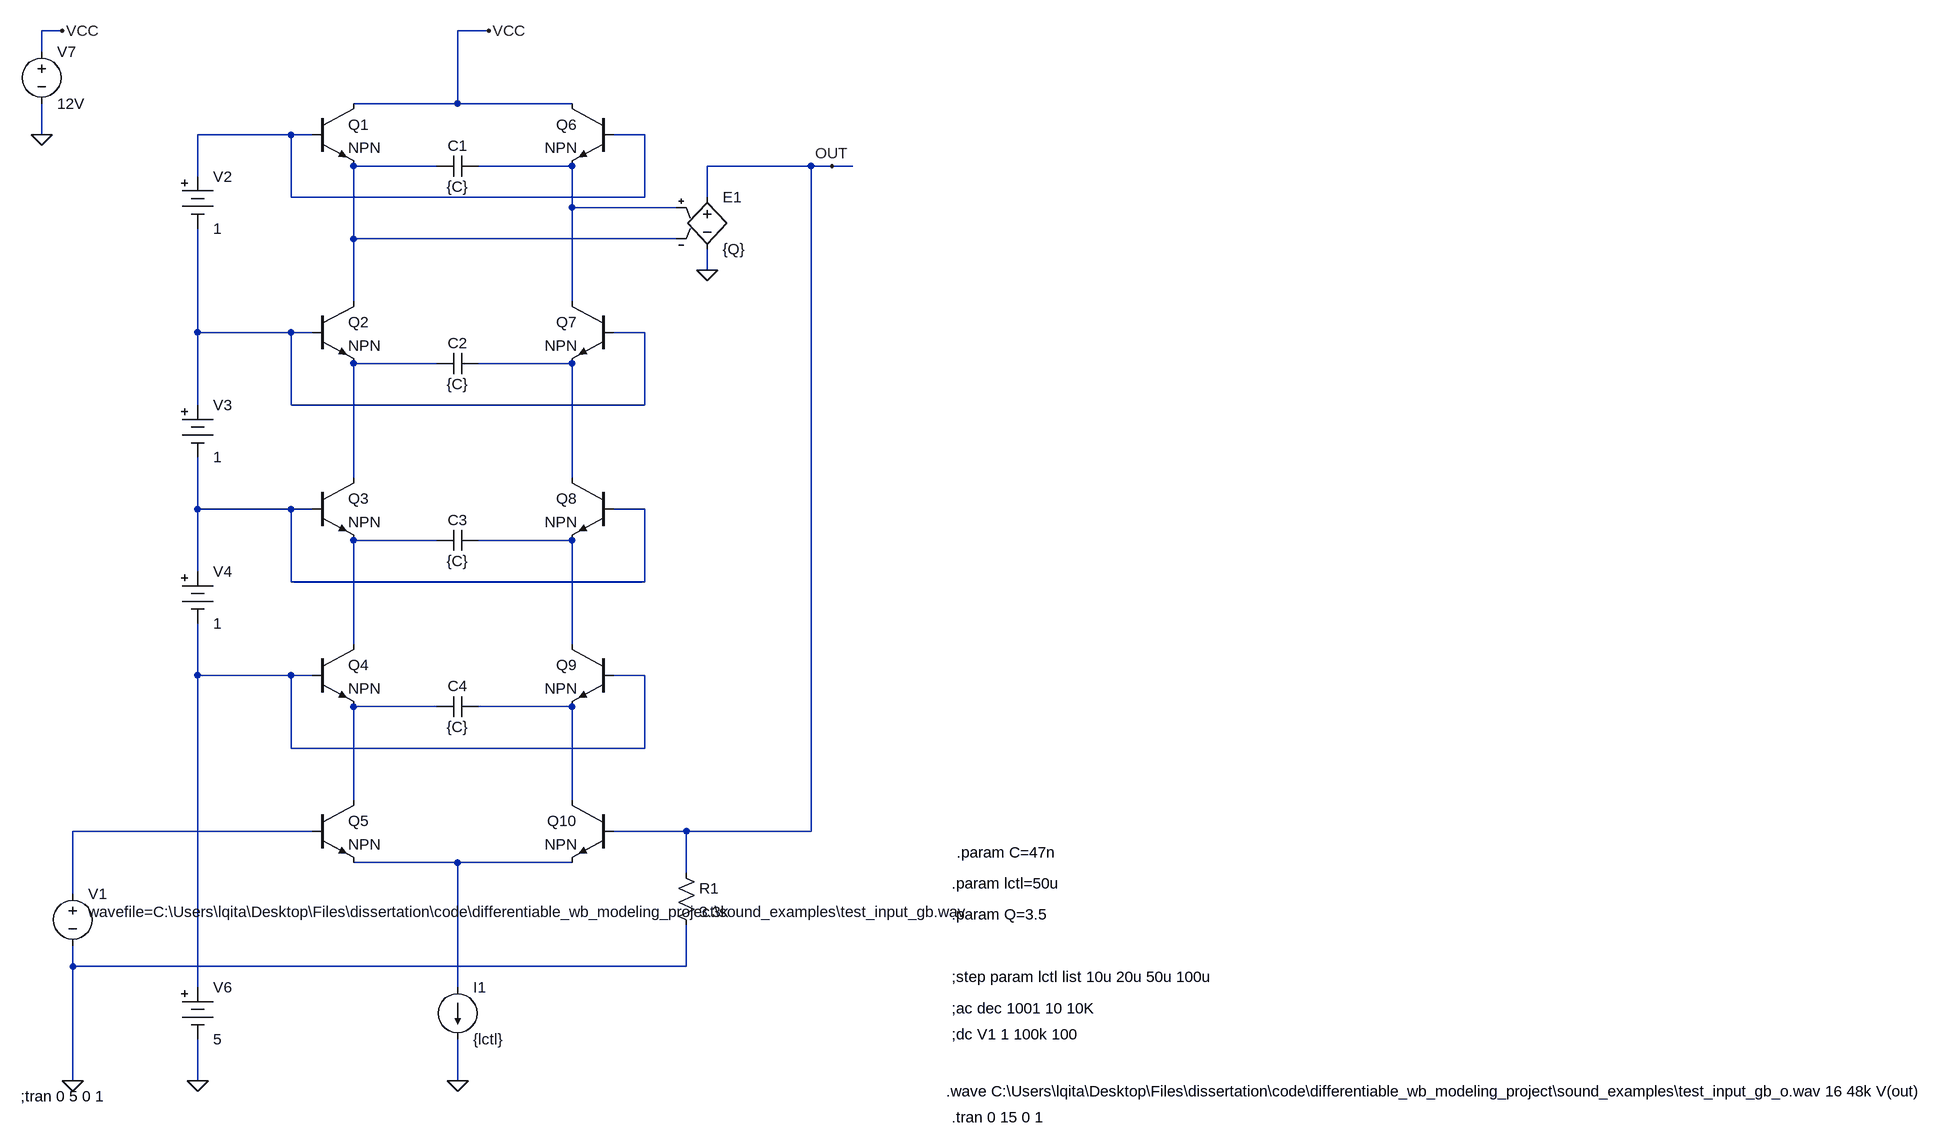
[diagram p0: schematic MoogVCF.asc]
MoogVCF.asc, the LTspice schematic file:
Version 4
SHEET 1 2832 1924
WIRE -272 -256 -304 -256
WIRE 384 -256 336 -256
WIRE -304 -224 -304 -256
WIRE 336 -144 336 -256
WIRE 336 -144 176 -144
WIRE 512 -144 336 -144
WIRE -304 -96 -304 -144
WIRE 80 -96 -64 -96
WIRE 112 -96 80 -96
WIRE 624 -96 576 -96
WIRE 304 -48 176 -48
WIRE 512 -48 368 -48
WIRE 880 -48 720 -48
WIRE 912 -48 880 -48
WIRE 944 -48 912 -48
WIRE -64 -32 -64 -96
WIRE 80 0 80 -96
WIRE 624 0 624 -96
WIRE 624 0 80 0
WIRE 720 0 720 -48
WIRE 512 16 512 -48
WIRE 672 16 512 16
WIRE 176 64 176 -48
WIRE 672 64 176 64
WIRE 720 112 720 80
WIRE 176 160 176 64
WIRE 512 160 512 16
WIRE -64 208 -64 48
WIRE 80 208 -64 208
WIRE 112 208 80 208
WIRE 624 208 576 208
WIRE 304 256 176 256
WIRE 512 256 368 256
WIRE -64 320 -64 208
WIRE 80 320 80 208
WIRE 624 320 624 208
WIRE 624 320 80 320
WIRE 176 432 176 256
WIRE 512 432 512 256
WIRE -64 480 -64 400
WIRE 80 480 -64 480
WIRE 112 480 80 480
WIRE 624 480 576 480
WIRE 304 528 176 528
WIRE 512 528 368 528
WIRE -64 576 -64 480
WIRE 80 592 80 480
WIRE 624 592 624 480
WIRE 624 592 80 592
WIRE 176 688 176 528
WIRE 512 688 512 528
WIRE -64 736 -64 656
WIRE 80 736 -64 736
WIRE 112 736 80 736
WIRE 624 736 576 736
WIRE 304 784 176 784
WIRE 512 784 368 784
WIRE 80 848 80 736
WIRE 624 848 624 736
WIRE 624 848 80 848
WIRE 176 928 176 784
WIRE 512 928 512 784
WIRE 112 976 -256 976
WIRE 688 976 576 976
WIRE 880 976 880 -48
WIRE 880 976 688 976
WIRE 336 1024 176 1024
WIRE 512 1024 336 1024
WIRE 688 1040 688 976
WIRE -256 1072 -256 976
WIRE -256 1184 -256 1152
WIRE 688 1184 688 1120
WIRE 688 1184 -256 1184
WIRE -64 1216 -64 736
WIRE 336 1216 336 1024
WIRE -256 1360 -256 1184
WIRE -64 1360 -64 1296
WIRE 336 1360 336 1296
FLAG 720 112 0
FLAG -256 1360 0
FLAG -64 1360 0
FLAG 336 1360 0
FLAG 384 -256 VCC
FLAG -272 -256 VCC
FLAG -304 -96 0
FLAG 912 -48 OUT
SYMBOL npn 112 -144 R0
SYMATTR InstName Q1
SYMBOL npn 112 160 R0
SYMATTR InstName Q2
SYMBOL npn 112 432 R0
SYMATTR InstName Q3
SYMBOL npn 112 688 R0
SYMATTR InstName Q4
SYMBOL npn 112 928 R0
SYMATTR InstName Q5
SYMBOL npn 576 -144 M0
SYMATTR InstName Q6
SYMBOL npn 576 160 M0
SYMATTR InstName Q7
SYMBOL npn 576 432 M0
SYMATTR InstName Q8
SYMBOL npn 576 688 M0
SYMATTR InstName Q9
SYMBOL npn 576 928 M0
SYMATTR InstName Q10
SYMBOL cap 368 -64 R90
WINDOW 0 0 32 VBottom 2
WINDOW 3 32 32 VTop 2
SYMATTR InstName C1
SYMATTR Value {C}
SYMBOL cap 368 240 R90
WINDOW 0 0 32 VBottom 2
WINDOW 3 32 32 VTop 2
SYMATTR InstName C2
SYMATTR Value {C}
SYMBOL cap 368 512 R90
WINDOW 0 0 32 VBottom 2
WINDOW 3 32 32 VTop 2
SYMATTR InstName C3
SYMATTR Value {C}
SYMBOL cap 368 768 R90
WINDOW 0 0 32 VBottom 2
WINDOW 3 32 32 VTop 2
SYMATTR InstName C4
SYMATTR Value {C}
SYMBOL current 336 1216 R0
WINDOW 123 0 0 Left 0
WINDOW 39 0 0 Left 0
SYMATTR InstName I1
SYMATTR Value {lctl}
SYMBOL voltage -256 1056 R0
WINDOW 3 24 44 Left 2
WINDOW 123 24 72 Left 2
WINDOW 39 0 0 Left 0
SYMATTR Value wavefile=C:\Users\lqita\Desktop\Files\dissertation\code\differentiable_wb_modeling_project\sound_examples\test_input_gb.wav
SYMATTR InstName V1
SYMBOL e 720 -16 R0
SYMATTR InstName E1
SYMATTR Value {Q}
SYMBOL Misc\\battery -64 -48 R0
SYMATTR InstName V2
SYMATTR Value 1
SYMBOL Misc\\battery -64 304 R0
SYMATTR InstName V3
SYMATTR Value 1
SYMBOL Misc\\battery -64 560 R0
SYMATTR InstName V4
SYMATTR Value 1
SYMBOL Misc\\battery -64 1200 R0
WINDOW 123 0 0 Left 0
WINDOW 39 0 0 Left 0
SYMATTR InstName V6
SYMATTR Value 5
SYMBOL res 672 1024 R0
SYMATTR InstName R1
SYMATTR Value 3.3k
SYMBOL voltage -304 -240 R0
SYMATTR InstName V7
SYMATTR Value 12V
TEXT 1096 1288 Left 2 !;dc V1 1 100k 100
TEXT 1096 1200 Left 2 !;step param lctl list 10u 20u 50u 100u
TEXT 1096 1248 Left 2 !;ac dec 1001 10 10K
TEXT 1096 1104 Left 2 !.param Q=3.5
TEXT 1096 1056 Left 2 !.param lctl=50u
TEXT -336 1384 Left 2 !;tran 0 5 0 1
TEXT 1088 1376 Left 2 !.wave C:\\Users\\lqita\\Desktop\\Files\\dissertation\\code\\differentiable_wb_modeling_project\\sound_examples\\test_input_gb_o.wav 16 48k V(out)
TEXT 1096 1416 Left 2 !.tran 0 15 0 1
TEXT 1104 1008 Left 2 !.param C=47n

The netlist it stands for:
* MoogVCF.asc
Q1 VCC N001 N002 0 NPN
Q2 N002 N004 N005 0 NPN
Q3 N005 N007 N008 0 NPN
Q4 N008 N010 N011 0 NPN
Q5 N011 N013 N014 0 NPN
Q6 VCC N001 N003 0 NPN
Q7 N003 N004 N006 0 NPN
Q8 N006 N007 N009 0 NPN
Q9 N009 N010 N012 0 NPN
Q10 N012 OUT N014 0 NPN
C1 N003 N002 {C}
C2 N006 N005 {C}
C3 N009 N008 {C}
C4 N012 N011 {C}
I1 N014 0 {lctl}
V1 N013 0 wavefile=C:\Users\lqita\Desktop\Files\dissertation\code\differentiable_wb_modeling_project\sound_examples\test_input_gb.wav
E1 OUT 0 N003 N002 {Q}
V2 N001 N004 1
V3 N004 N007 1
V4 N007 N010 1
V6 N010 0 5
R1 OUT 0 3.3k
V7 VCC 0 12V
.model NPN NPN
.model PNP PNP
.lib standard.bjt
;dc V1 1 100k 100
;step param lctl list 10u 20u 50u 100u
;ac dec 1001 10 10K
.param Q=3.5
.param lctl=50u
;tran 0 5 0 1
.wave C:\Users\lqita\Desktop\Files\dissertation\code\differentiable_wb_modeling_project\sound_examples\test_input_gb_o.wav 16 48k V(out)
.tran 0 15 0 1
.param C=47n
.backanno
.end